# Altium schematic sheet IF_AMP.SchDoc
size A4
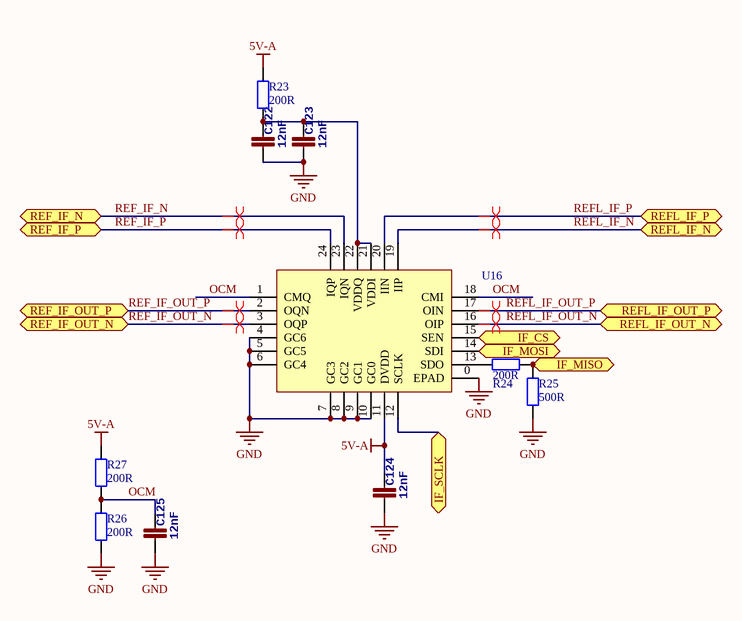
[diagram p0: IF_AMP.SchDoc]

## Parts
C122  12nF  [0402]
C123  12nF  [0402]
C124  12nF  [0402]
C125  12nF  [0402]
R23  200R  [0402]
R24  200R  [0402]
R25  500R  [0402]
R26  200R  [0402]
R27  200R  [0402]
U16  HMC960  [HMC960]  (value not drawn)

## Ports
IF_CS, IF_MISO, IF_MOSI, IF_SCLK, REF_IF_N, REF_IF_OUT_N, REF_IF_OUT_P, REF_IF_P, REFL_IF_N, REFL_IF_OUT_N, REFL_IF_OUT_P, REFL_IF_P

## Nets
5V-A: C124.2 R23.1 R27.1 U16.11(DVDD)
GND: C122.1 C123.1 C124.1 C125.1 R25.1 R26.2 U16.0(EPAD) U16.4(GC6) U16.5(GC5) U16.6(GC4) U16.7(GC3) U16.8(GC2) U16.9(GC1) U16.10(GC0)
IF_CS: U16.15(SEN) ; port IF_CS
IF_MISO: R24.2 R25.2 ; port IF_MISO
IF_MOSI: U16.14(SDI) ; port IF_MOSI
IF_SCLK: U16.12(SCLK) ; port IF_SCLK
OCM: C125.2 R26.1 R27.2 U16.1(CMQ) U16.18(CMI)
REF_IF_N: U16.23(IQN) ; port REF_IF_N
REF_IF_OUT_N: U16.3(OQP) ; port REF_IF_OUT_N
REF_IF_OUT_P: U16.2(OQN) ; port REF_IF_OUT_P
REF_IF_P: U16.24(IQP) ; port REF_IF_P
REFL_IF_N: U16.19(IIP) ; port REFL_IF_N
REFL_IF_OUT_N: U16.16(OIP) ; port REFL_IF_OUT_N
REFL_IF_OUT_P: U16.17(OIN) ; port REFL_IF_OUT_P
REFL_IF_P: U16.20(IIN) ; port REFL_IF_P
NetC122_2: C122.2 C123.2 R23.2 U16.21(VDDI) U16.22(VDDQ)
NetR24_1: R24.1 U16.13(SDO)

## Layout directives
differential pair: REF_IF_N, REF_IF_OUT_N, REF_IF_OUT_P, REF_IF_P, REFL_IF_N, REFL_IF_OUT_N, REFL_IF_OUT_P, REFL_IF_P

## Library data of the parts
C122-C125 = CAP0402-CAP: <b>Capacitor</b> / Standard 0603 ceramic capacitor, and 0.1" leaded capacitor.; PARTNO: CC0402ZRY5V7BB104
R23-R27 = Res2: Resistor; Published: 8-Jun-2000; LatestRevisionDate: 17-Jul-2002; LatestRevisionNote: Re-released for DXP Platform.; PackageReference: AXIAL-0.4; Publisher: Altium Limited; PackageDescription: Axial Device, Thru-Hole; 2 Leads; 0.4 in Pin Spacing